# EAGLE board Master (EAGLE 6.5.0)
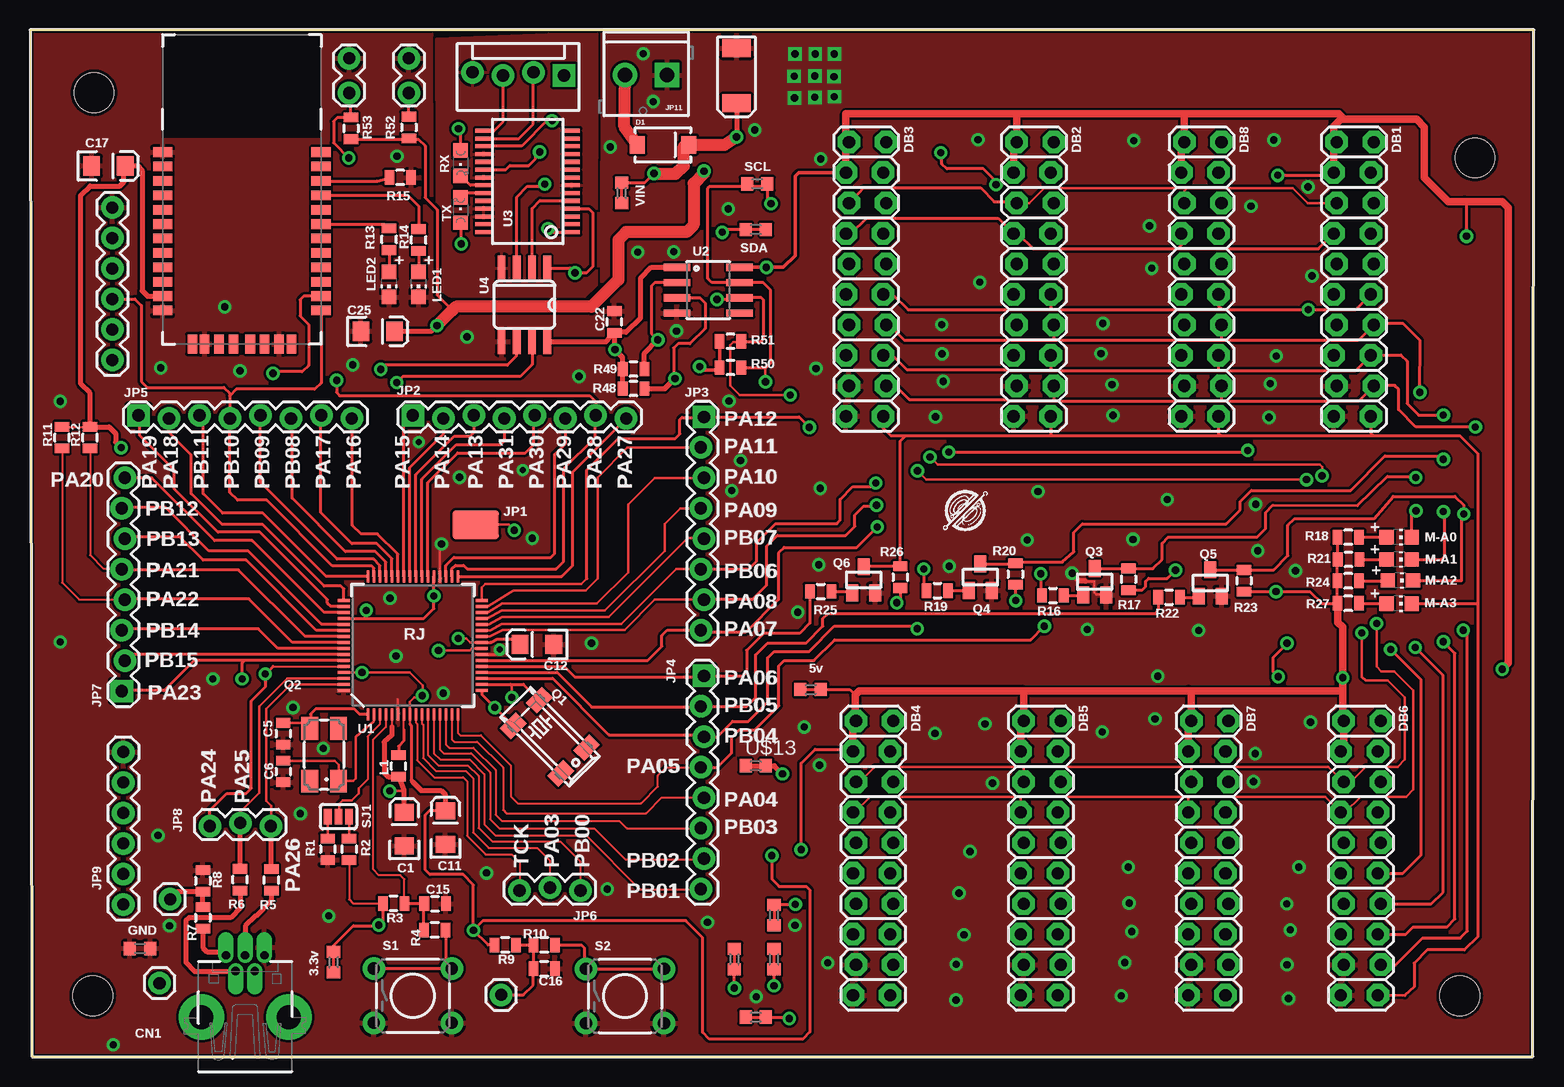
[diagram p4: board, top side]
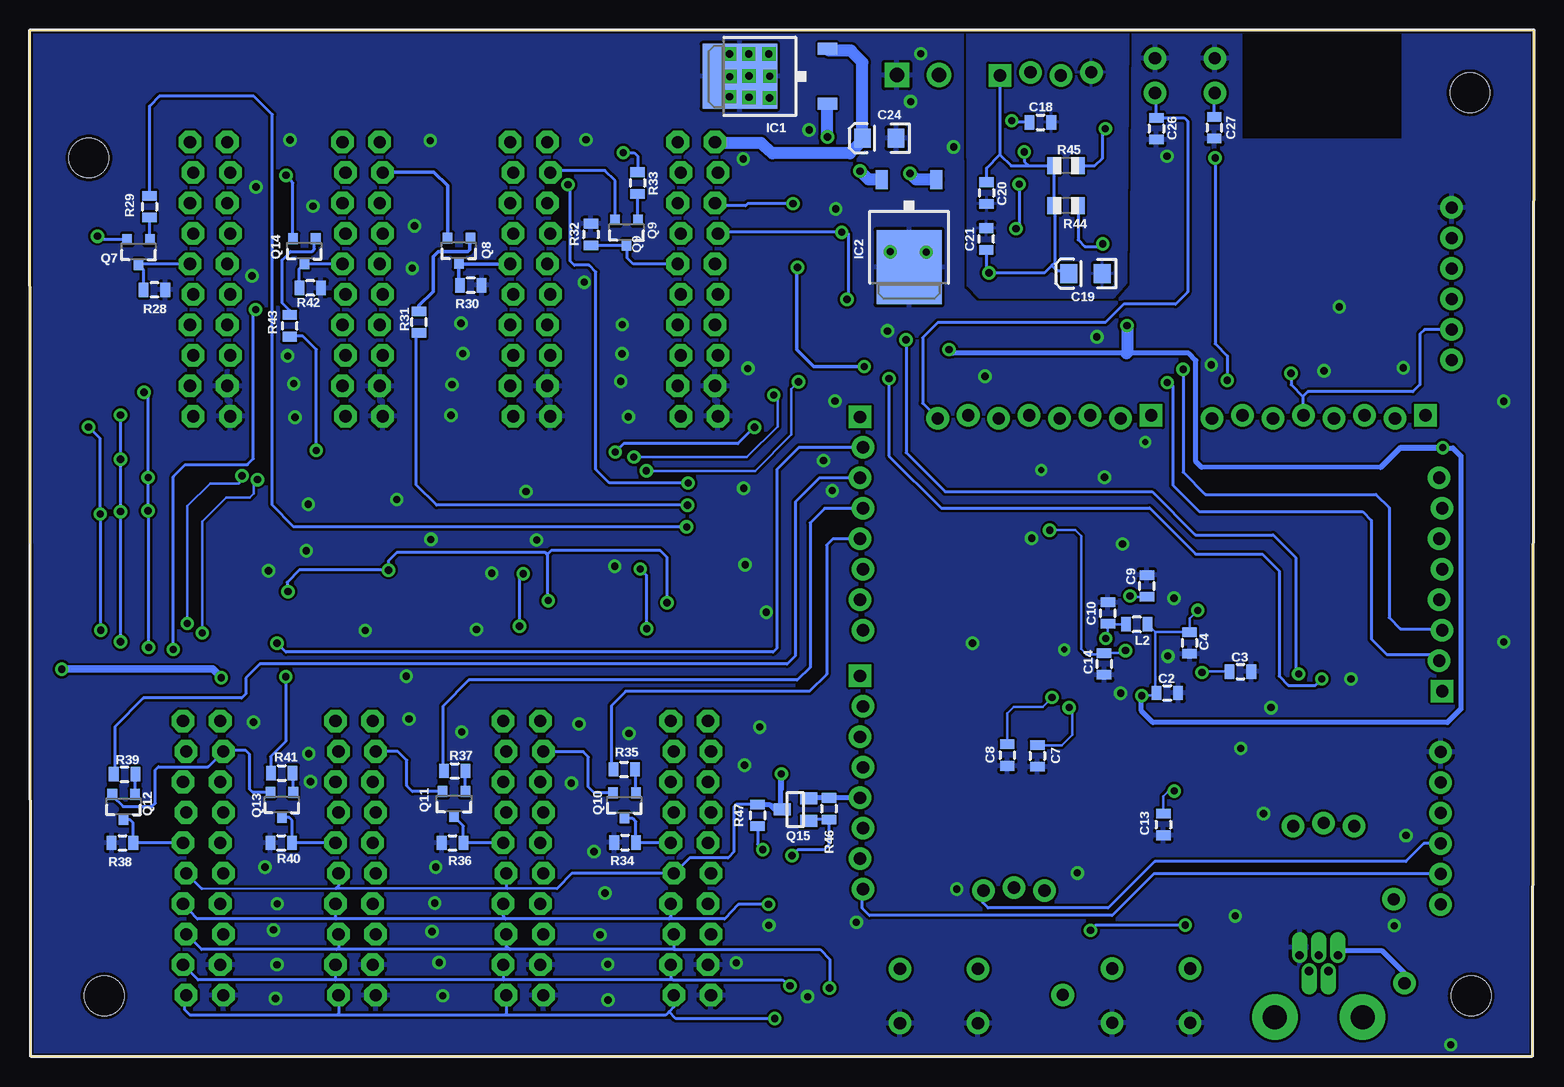
[diagram p5: board, bottom side, seen from below]

Size 125.33 x 85.6 mm. Coordinates in mm from the lower left corner, seen from the top.
Outline: 0.15,0 125.25,0 125.33,85.6 0,85.6 0.15,0
Copper layers (1*16): Top 0.035mm / dielectric 1.5mm / Bottom 0.035mm
Design rules "SparkFun": minimum track width 8mil, minimum drill 20mil, track to track 8mil, track to pad 8mil, pad to pad 8mil, via to via 8mil, smd to smd 8mil, copper to edge 10mil, drill to drill 8mil, minimum pad ring 12mil, minimum via ring 10mil, stop-mask expansion 4mil, vias tented up to drill 25mil, thermal gap 10mil
tRestrict: area 11,76.6 to 24.2,85.3
bRestrict: area 11,76.6 to 24.3,85.2

## Footprints (pad centres in the part's own frame; a part is rotated, then mirrored left to right if it is on the bottom)
EIA3216 = smd 1.4 x 1.6: A 1.4,0; C -1.4,0
0805 = smd 0.8 x 1.2: 1 -0.9,0; 2 0.9,0
EIA6032 = smd 1.5 x 2.4: P$1 -2.3,0; P$2 2.3,0
USB-MINIB-THM-MOLEX = drill 0.7 offset: D+ 0,9.72; D- -0.8,8.42; GND 1.6,9.72; ID 0.8,8.42; VBUS -1.6,9.72 | drill 2 pad 3.81: GND1 -3.65,4.57; GND4 3.65,4.57
SMA-DIODE = smd 1.27 x 1.47: A -2.15,0; C 2.15,0
2X10_LOCK_SPECIAL = drill 1.016 pad 1.88 octagon: 1 -11.43,-1.422; 2 -11.43,1.676; 3 -8.89,-1.676; 4 -8.89,1.422; 5 -6.35,-1.422; 6 -6.35,1.676; 7 -3.81,-1.676; 8 -3.81,1.422; 9 -1.27,-1.422; 10 -1.27,1.676; 11 1.27,-1.676; 12 1.27,1.422; 13 3.81,-1.422; 14 3.81,1.676; 15 6.35,-1.676; 16 6.35,1.422; 17 8.89,-1.422; 18 8.89,1.676; 19 11.43,-1.676; 20 11.43,1.422
TO252 = smd 1 x 1.6: 1 -2.28,-4.8; 2 2.28,-4.8 | smd 5.4 x 6.2: 3 0,2.5
LUXEON-PAD = smd 3.9 x 2.4: P$1 0,0
1X08_LOCK = drill 1.016 pad 1.88 square: 1 0,0.127 | drill 1.016 pad 1.88: 2 2.54,-0.127; 3 5.08,0.127; 4 7.62,-0.127; 5 10.16,0.127; 6 12.7,-0.127; 7 15.24,0.127; 8 17.78,-0.127
1X03_LOCK = drill 1.016 pad 1.88: 1 0,0.127; 2 2.54,-0.127; 3 5.08,0.127
FTDI_BASIC = drill 1.016 pad 1.88: CTS 10.16,0; DTR 0,0; GND 12.7,0; RXI 2.54,0; TXO 5.08,0; VCC 7.62,0
SCREWTERMINAL-3.5MM-2 = drill 1.2 pad 2.032 square: 1 0,0 | drill 1.2 pad 2.032: 2 3.5,0
MOLEX-1X4_LOCK = drill 1.016 pad 1.88 square: 1 0,0.127 | drill 1.016 pad 1.88: 2 2.54,-0.127; 3 5.08,0.127; 4 7.62,-0.127
1X01 = drill 1.016 pad 1.88: 1 0,0
1X02_LOCK = drill 1.016 pad 1.88: 1 -0.178,0; 2 2.718,0
CHIP-LED0805 = smd 1.2 x 1.2: A 0,-1.05; C 0,1.05
MM20SS = smd 1.27 x 1.88: 1 -2.794,-1.524; 2 2.794,-1.524; 3 2.794,1.524; 4 -2.794,1.524
CTS406 = smd 1.9 x 1.4: 1 -2.2,-1.2; 2 2.2,-1.2; 3 2.2,1.2; 4 -2.2,1.2
SOT23 = smd 1 x 1.4: 1 -0.95,-1.1; 2 0.95,-1.1; 3 0,1.1
SOT23-3 = smd 0.8 x 0.9: 1 -0.95,-1; 2 0.95,-1; 3 0,1.1
R0805 = smd 1.1 x 1.4: 1 -1,0; 2 1,0
CHIPLED_0805 = smd 1.2 x 1.2: A 0,-1.05; C 0,1.05
TACTILE-PTH = drill 1.016 pad 1.88: 1 -3.251,2.261; 2 3.251,2.261; 3 -3.251,-2.261; 4 3.251,-2.261
SJ_3 = smd 0.635 x 1.27: 1 -0.889,0; 2 0,0; 3 0.889,0
STAND-OFF = hole 3.302: 0,0
TQFP-64 = smd 0.22 x 1: 1 -3.75,-5.75; 2 -3.25,-5.75; 3 -2.75,-5.75; 4 -2.25,-5.75; 5 -1.75,-5.75; 6 -1.25,-5.75; 7 -0.75,-5.75; 8 -0.25,-5.75; 9 0.25,-5.75; 10 0.75,-5.75; 11 1.25,-5.75; 12 1.75,-5.75; 13 2.25,-5.75; 14 2.75,-5.75; 15 3.25,-5.75; 16 3.75,-5.75; 33 3.75,5.75; 34 3.25,5.75; 35 2.75,5.75; 36 2.25,5.75; 37 1.75,5.75; 38 1.25,5.75; 39 0.75,5.75; 40 0.25,5.75; 41 -0.25,5.75; 42 -0.75,5.75; 43 -1.25,5.75; 44 -1.75,5.75; 45 -2.25,5.75; 46 -2.75,5.75; 47 -3.25,5.75; 48 -3.75,5.75 | smd 1 x 0.22: 17 5.75,-3.75; 18 5.75,-3.25; 19 5.75,-2.75; 20 5.75,-2.25; 21 5.75,-1.75; 22 5.75,-1.25; 23 5.75,-0.75; 24 5.75,-0.25; 25 5.75,0.25; 26 5.75,0.75; 27 5.75,1.25; 28 5.75,1.75; 29 5.75,2.25; 30 5.75,2.75; 31 5.75,3.25; 32 5.75,3.75; 49 -5.75,3.75; 50 -5.75,3.25; 51 -5.75,2.75; 52 -5.75,2.25; 53 -5.75,1.75; 54 -5.75,1.25; 55 -5.75,0.75; 56 -5.75,0.25; 57 -5.75,-0.25; 58 -5.75,-0.75; 59 -5.75,-1.25; 60 -5.75,-1.75; 61 -5.75,-2.25; 62 -5.75,-2.75; 63 -5.75,-3.25; 64 -5.75,-3.75
SO-8 = smd 0.61 x 2.21: 1 -1.905,-2.616; 2 -0.635,-2.616; 3 0.635,-2.616; 4 1.905,-2.616; 5 1.905,2.616; 6 0.635,2.616; 7 -0.635,2.616; 8 -1.905,2.616
SSOP28DB = smd 0.348 x 1.397: 1 -4.225,-3.656; 2 -3.575,-3.656; 3 -2.925,-3.656; 4 -2.275,-3.656; 5 -1.625,-3.656; 6 -0.975,-3.656; 7 -0.325,-3.656; 8 0.325,-3.656; 9 0.975,-3.656; 10 1.625,-3.656; 11 2.275,-3.656; 12 2.925,-3.656; 13 3.575,-3.656; 14 4.225,-3.656; 15 4.225,3.656; 16 3.575,3.656; 17 2.925,3.656; 18 2.275,3.656; 19 1.625,3.656; 20 0.975,3.656; 21 0.325,3.656; 22 -0.325,3.656; 23 -0.975,3.656; 24 -1.625,3.656; 25 -2.275,3.656; 26 -2.925,3.656; 27 -3.575,3.656; 28 -4.225,3.656
SOIC-8 = smd 0.66 x 2.032: 1 -1.905,-3.073; 2 -0.635,-3.073; 3 0.635,-3.073; 4 1.905,-3.073; 5 1.905,3.073; 6 0.635,3.073; 7 -0.635,3.073; 8 -1.905,3.073
RN41 = smd 0.8 x 1.6: 1 -6.6,-6.6; 2 -5.4,-6.6; 3 -4.2,-6.6; 4 -3,-6.6; 5 -1.8,-6.6; 6 -0.6,-6.6; 7 0.6,-6.6; 8 1.8,-6.6; 9 3,-6.6; 10 4.2,-6.6; 11 5.4,-6.6; 12 6.6,-6.6; 13 6.6,6.6; 14 5.4,6.6; 15 4.2,6.6; 16 3,6.6; 17 1.8,6.6; 18 0.6,6.6; 19 -0.6,6.6; 20 -1.8,6.6; 21 -3,6.6; 22 -4.2,6.6; 23 -5.4,6.6; 24 -6.6,6.6 | smd 1.6 x 0.8: 28 9.4,3.1; 29 9.4,-3.1; 30 9.4,4.122; 31 9.4,1.9; 32 9.4,0.7; 33 9.4,-0.7; 34 9.4,-1.9; 35 9.4,-4.122
R0603 = smd 1 x 1.1: 1 -0.85,0; 2 0.85,0

## Placement (x,y rotation side)
C1  10uF  [EIA3216]  31.19,18.97 90 top
C2  0.1uF  [0805]  30.56,30.33 0 bottom
C3  0.1uF  [0805]  24.46,32.11 0 bottom
C4  0.1uF  [0805]  28.7,34.49 270 bottom
C5  18pF  [0805]  21.11,26.92 270 top
C6  18pF  [0805]  21.11,23.77 270 top
C7  12.5pF  [0805]  41.38,25.07 270 bottom
C8  12.5pF  [0805]  43.89,25.15 270 bottom
C9  0.1uF  [0805]  32.26,39.24 90 bottom
C10  0.1uF  [0805]  35.51,36.98 90 bottom
C11  10uF  [EIA3216]  34.62,19.1 90 top
C12  10uF  [EIA3216]  42.24,34.37 180 top
C13  0.1uF  [0805]  30.89,19.35 270 bottom
C14  0.1uF  [0805]  35.81,32.74 270 bottom
C15  0.01uF  [0805]  33.76,12.75 0 top
C16  0.01uF  [0805]  42.85,7.34 0 top
C17  10uF  [EIA3216]  6.53,74.27 0 top
C18  0.1uf  [0805]  41.12,77.9 0 bottom
C19  10uF  [EIA3216]  37.36,65.28 180 bottom
C20  0.1uf  [0805]  45.62,72.01 270 bottom
C21  0.1uf  [0805]  45.64,68.17 90 bottom
C22  0.1uf  [0805]  48.69,61.26 90 top
C23  10uF  [EIA6032]  58.88,81.79 90 top
C24  10uF  [EIA3216]  54.56,76.58 180 bottom
C25  10uF  [EIA3216]  28.98,60.48 0 top
C26  0.01uF  [0805]  31.47,77.37 270 bottom
C27  0.01uF  [0805]  26.64,77.44 270 bottom
CN1  [USB-MINIB-THM-MOLEX]  17.93,-1.27 0 top
D1  [SMA-DIODE]  52.76,76.02 0 top
DB1  [2X10_LOCK_SPECIAL]  110.31,64.82 270 top
DB2  [2X10_LOCK_SPECIAL]  83.64,64.82 270 top
DB3  [2X10_LOCK_SPECIAL]  69.67,64.82 270 top
DB4  [2X10_LOCK_SPECIAL]  70.26,16.56 270 top
DB5  [2X10_LOCK_SPECIAL]  84.23,16.56 270 top
DB6  [2X10_LOCK_SPECIAL]  110.9,16.56 270 top
DB7  [2X10_LOCK_SPECIAL]  98.2,16.56 270 top
DB8  [2X10_LOCK_SPECIAL]  97.61,64.82 270 top
IC1  7805  [TO252]  63.68,81.74 90 bottom
IC2  LD29080DT33R  [TO252]  52.07,68.33 180 bottom
JP1  M01SMD  [LUXEON-PAD]  37.13,44.35 0 top
JP2  [1X08_LOCK]  31.9,53.34 0 top
JP3  [1X08_LOCK]  56.03,53.34 270 top
JP4  [1X08_LOCK]  56.03,31.75 270 top
JP5  [1X08_LOCK]  9.04,53.34 0 top
JP6  [1X03_LOCK]  45.87,13.97 180 top
JP7  [1X08_LOCK]  7.77,30.48 90 top
JP8  [1X03_LOCK]  20.07,19.35 180 top
JP9  FTDI  [FTDI_BASIC]  7.77,12.7 90 top
JP10  FTDI_BASICPTH  [FTDI_BASIC]  6.86,58.09 90 top
JP11  M023.5MM  [SCREWTERMINAL-3.5MM-2]  53.09,81.84 180 top
JP12  [MOLEX-1X4_LOCK]  44.5,81.94 180 top
JP13  M01PTH  [1X01]  39.27,5.16 0 top
JP14  E-STOP  [1X02_LOCK]  26.59,83.06 270 top
JP15  KEY  [1X02_LOCK]  31.57,83.06 270 top
JP16  M01PTH  [1X01]  11.68,13.13 0 top
JP17  M01PTH  [1X01]  10.79,6.12 0 top
L1  22uH  [0805]  30.71,24.23 90 top
L2  FB -1.5k@100Mz  [0805]  33.1,36.04 180 bottom
LED1  [CHIP-LED0805]  32.38,64.39 180 top
LED2  [CHIP-LED0805]  29.92,64.39 180 top
M-A0  Green  [CHIP-LED0805]  114.1,43.31 270 top
M-A1  [CHIP-LED0805]  114.1,41.45 270 top
M-A2  [CHIP-LED0805]  114.2,39.7 270 top
M-A3  [CHIP-LED0805]  114.1,37.77 270 top
Q1  32.768khz  [MM20SS]  43.33,26.67 315 top
Q2  12Mhz  [CTS406]  24.51,25.17 90 top
Q3  BSS123  [SOT23]  88.72,39.6 0 top
Q4  BSS123  [SOT23]  79.2,39.98 0 top
Q5  BSS123  [SOT23]  98.35,39.5 0 top
Q6  BSS123  [SOT23]  69.47,39.75 0 top
Q7  PMBT3906  [SOT23-3]  116.28,67.13 180 bottom
Q8  PMBT3906  [SOT23-3]  89.59,67.23 180 bottom
Q9  PMBT3906  [SOT23-3]  75.62,68.76 180 bottom
Q10  PMBT3906  [SOT23-3]  75.79,21.01 180 bottom
Q11  PMBT3906  [SOT23-3]  89.99,21.11 180 bottom
Q12  PMBT3906  [SOT23-3]  117.53,20.88 180 bottom
Q13  PMBT3906  [SOT23-3]  104.34,21.03 180 bottom
Q14  PMBT3906  [SOT23-3]  102.46,67.21 180 bottom
Q15  BSS123  [SOT23]  61.54,20.6 90 bottom
R1  100k  [0805]  24.82,17.3 270 top
R2  100k  [0805]  26.59,17.3 270 top
R3  100k  [0805]  30.3,12.78 180 top
R4  10  [0805]  33.73,10.57 180 top
R5  39  [0805]  20.12,14.73 90 top
R6  39  [0805]  17.5,14.76 90 top
R7  820k  [0805]  14.4,11.58 270 top
R8  1M  [0805]  14.4,14.66 270 top
R9  100k  [0805]  39.6,9.32 180 top
R10  10  [0805]  42.85,9.32 180 top
R11  2.2k  [0805]  2.67,51.61 90 top
R12  2.2k  [0805]  5,51.61 90 top
R13  330  [0805]  29.92,68.15 90 top
R14  330  [0805]  32.38,68.1 90 top
R15  10k  [0805]  30.86,73.3 180 top
R16  1k  [0805]  85.24,38.46 0 top
R17  10k  [0805]  91.54,39.8 270 top
R18  1k  [0805]  109.86,43.31 180 top
R19  1k  [0805]  75.62,38.86 0 top
R20  10k  [0805]  82.12,40.23 270 top
R21  1k  [0805]  109.88,41.45 180 top
R22  1k  [0805]  94.92,38.3 0 top
R23  10k  [0805]  101.17,39.67 270 top
R24  1k  [0805]  109.86,39.67 180 top
R25  1k  [0805]  65.89,38.79 0 top
R26  10k  [0805]  72.52,39.98 270 top
R27  1k  [0805]  109.86,37.8 180 top
R28  10k  [0805]  114.96,63.93 180 bottom
R29  1k  [0805]  115.37,70.87 270 bottom
R30  10k  [0805]  88.6,64.31 180 bottom
R31  1k  [0805]  92.91,61.24 90 bottom
R32  10k  [0805]  78.59,68.55 270 bottom
R33  1k  [0805]  74.7,72.85 270 bottom
R34  10k  [0805]  75.74,17.86 0 bottom
R35  1k  [0805]  75.82,23.95 0 bottom
R36  10k  [0805]  90.12,17.83 0 bottom
R37  1k  [0805]  89.94,23.83 0 bottom
R38  10k  [0805]  117.63,17.83 0 bottom
R39  1k  [0805]  117.45,23.55 0 bottom
R40  10k  [0805]  104.39,17.83 0 bottom
R41  1k  [0805]  104.34,23.65 0 bottom
R42  10k  [0805]  101.98,64.08 180 bottom
R43  1k  [0805]  103.68,60.93 90 bottom
R44  1K  [R0805]  38.99,70.94 180 bottom
R45  1k  [R0805]  38.99,74.3 180 bottom
R46  10k  [0805]  58.75,20.68 270 bottom
R47  10k  [0805]  64.69,20.12 270 bottom
R48  10k  [0805]  50.29,55.7 180 top
R49  10k  [0805]  50.29,57.33 180 top
R50  10k  [0805]  58.37,57.45 180 top
R51  10k  [0805]  58.37,59.64 180 top
R52  100k  [0805]  31.57,77.47 270 top
R53  100k  [0805]  26.75,77.39 270 top
RX  [CHIPLED_0805]  35.89,74.5 180 top
S1  RSET  [TACTILE-PTH]  31.9,5.08 0 top
S2  BOOT  [TACTILE-PTH]  49.58,5.05 0 top
SJ1  [SJ_3]  25.7,20.02 180 top
STANDOFF1  STAND-OFF  [STAND-OFF]  5.23,5.08 0 top
STANDOFF2  STAND-OFF  [STAND-OFF]  119.15,5.08 0 top
STANDOFF3  STAND-OFF  [STAND-OFF]  5.33,80.37 0 top
STANDOFF4  STAND-OFF  [STAND-OFF]  120.42,74.93 0 top
TX  [CHIPLED_0805]  35.89,70.59 0 top
U1  ATSAM4LS  [TQFP-64]  31.9,34.29 0 top
U2  PCA9508DPSO  [SO-8]  56.52,63.91 270 top
U3  FT232RL-BASICSSOP  [SSOP28DB]  41.48,72.97 90 top
U4  ISO7221ADR  [SOIC-8]  41.2,62.69 180 top
U$1  BLUETOOTH-RN41"  [RN41]  17.65,68.81 270 top
U$2  TESTPOINT  [R0603]  60.6,72.77 180 top
U$3  TESTPOINT  [R0603]  60.48,68.96 0 top
U$4  TESTPOINT  [R0603]  62,11.81 90 top
U$5  TESTPOINT  [R0603]  58.7,8.13 90 top
U$6  TESTPOINT  [R0603]  62,8.13 90 top
U$7  TESTPOINT  [R0603]  60.48,3.3 0 top
U$8  TESTPOINT  [R0603]  65.05,30.61 0 top
U$9  TESTPOINT  [R0603]  25.3,7.87 90 top
U$10  TESTPOINT  [R0603]  9.17,9.02 0 top
U$11  TESTPOINT  [R0603]  49.3,72.01 90 top
U$12  LOGO  [LOGO-S]  75.74,43.41 0 top
U$13  TESTPOINT  [R0603]  60.48,24.26 0 top

## Tracks (layer width: path | path; a pad name or v marks a point on that pad's centre or on a via)
3V  (via drill 0.6)
  Top 0.254: v43.51,78.03 43.08,78.03 40.97,75.92 37.84,75.92 U3.17
  Bottom 0.254: C18.1 43.38,77.9 v43.51,78.03
+3V3  (via drill 0.6)
  Top 0.178: U1.8 31.65,27.76 | R11.2 R12.2 | R2.2 26.59,13.11 26.9,12.8 29.38,12.8 R3.2
  Top 0.203: U1.8 31.65,29.59 32.03,29.97 32.56,29.97 v32.69,30.1 32.72,30.12 32.72,30.96 31.65,32.03 v27.66,32.03 U1.61 | v28.02,37.21 28.02,36.72 27.84,36.54
  Top 0.254: U1.52 27.84,36.54 32.83,36.54 33.66,37.36 v33.66,38.41 33.66,39.99 U1.37 | R3.2 29.4,11.32 v29.06,10.97 29.01,10.92 26.95,10.92 25.3,9.27 U$9.2 U$9.1 | v36.96,10.54 36.96,14.33 36.09,15.19 33.32,15.19 32.92,15.6 32.92,20.14 33.32,20.55 34.57,20.55 C11.A | R9.2 38.18,9.32 v36.96,10.54 | v61.82,16.76 61.82,14.81 62.43,14.2 64.69,14.2 65,13.89 65,2.06 64.41,1.47 56.62,1.47 56.06,2.03 56.06,9.93 54.66,11.33 37.74,11.33 v36.96,10.54 | R53.2 31.5,76.49 | 31.5,76.49 R52.2 | 31.5,76.49 32.37,76.49 32.92,75.95 32.92,71.63 33.93,70.61 33.93,63.5 35.19,62.24 | 31.65,27.76 31.65,27.71 31.75,27.61 31.75,23.04 31.88,22.91
  Top 0.406: 31.88,22.91 32.59,22.2 34.26,22.2 34.59,21.87 34.59,20.53 C11.A | U$1.11 11.04,63.4 9.8,63.4 9.35,63.86 9.35,73.89 8.97,74.27 C17.A 7.82,74.17 7.82,72.92 7.49,72.59 5,72.59 4.24,71.83 4.24,56.08 5,55.32 R12.2 6.59,52.51 7.14,51.97 7.14,51.23 v7.59,50.77 | U4.8 48.02,59.61 C22.1 | C22.1 48.73,60.4 49.68,60.4 50.88,61.59 50.88,64.9 51.79,65.81 U2.1 | C22.1 48.74,60.31 v48.74,58.95 49.39,58.3 R49.2 R48.2 | C25.A 33.43,60.48 v33.91,60.96
  Top 1.016: v56.16,73.84 56.16,73.66 55.3,72.8 55.3,69.34 54.71,68.76 49.68,68.76 49.02,68.1 49.02,64.77 46.79,62.53 35.48,62.53 35.19,62.24 v33.91,60.96
  Bottom 0.203: v32.69,30.1 31.68,30.1 C2.1 31.55,30.42 31.55,35.39 | C3.1 27.58,32.11 v27.66,32.03 | v28.02,37.21 28.7,36.52 C4.1 31.55,35.39 | C9.1 33.62,38.34 v33.66,38.41 | 31.55,35.39 L2.1
  Bottom 0.254: v29.06,10.97 36.53,10.97 v36.96,10.54 | Q15.1 60.32,19.78 R46.2 58.75,17.63 59.13,17.25 61.34,17.25 v61.82,16.76
  Bottom 0.406: v7.59,50.77 11.15,50.77 12.8,49.12 | 12.8,49.12 27.71,49.15 28.17,49.61 28.17,58.04 28.78,58.65 33.93,58.65 48.44,58.65 v48.74,58.95 | 12.8,49.12 12.78,49.12 11.15,50.75 6.76,50.75 6.1,50.09 6.1,28.98 7.21,27.86 31.75,27.86 32.72,28.83 32.72,30.07 v32.69,30.1
  Bottom 1.016: IC2.2 55.45,73.13 v56.16,73.84 | v33.91,60.96 33.91,58.67 33.93,58.65
+5V  (via drill 0.6)
  Top 0.254: R18.2 108.98,43.28 R21.2 108.96,41.43 R24.2 R27.2 108.93,37.77 107.67,37.77 106.67,38.77 v103.84,38.77 R23.2 | v64.26,17.27 64.26,24.46 65.43,25.63 68.4,25.63 DB4.3 | R26.2 72.52,38.12 v72.24,37.85 | v82.14,38.02 82.14,39.31 R20.2 | R17.2 92.67,38.9 92.96,39.19 92.96,39.62 93.22,39.88 94.77,39.88 v95.45,40.56 | v103.99,73.48 108.41,73.48 DB1.3 | v119.71,68.4 119.71,71.12 119.53,71.3 | U$8.1 U$8.2 68.3,30.61 68.76,30.15
  Top 0.305: U2.8 v61.37,65.81 62.79,65.81 63.78,66.8 63.78,73.43 64.06,73.71 DB3.3 | R50.2 R51.2 R50.2 57.28,57.25 56.08,57.25 v55.8,57.53
  Top 0.406: DB1.1 108.74,76.25 108.64,76.35
  Top 0.61: DB4.3 68.58,27.74 DB4.1 68.76,28.07 68.76,30.15 69.11,30.5 82.52,30.5 | DB5.3 82.55,27.74 DB5.1 82.8,30.4 82.7,30.5 | 82.55,30.48 82.52,30.5 | 82.52,30.5 82.7,30.5 | 82.7,30.5 96.55,30.5 | 96.55,30.5 109.4,30.5 | 109.4,30.5 109.4,28.07 DB6.1 109.47,25.7 DB6.3 | 96.55,30.5 96.77,30.28 DB7.1 96.52,27.74 DB7.3 | R27.2 108.99,37.76 108.99,36.22 109.4,35.81 v109.4,31.6 109.4,30.5 | DB1.3 108.64,76.35 108.64,77.57 109.22,78.16 109.52,78.16 | 109.52,78.16 115.54,78.16 116.21,77.5 116.21,73.28 118.19,71.3 119.53,71.3 122.68,71.3 123.19,70.79 123.19,32.82 v122.68,32.31 | DB3.3 68,76.35 | 68,76.35 68,78.61 82.32,78.61 | 82.32,78.61 96.06,78.61 | 96.06,78.61 109.07,78.61 109.52,78.16 | 96.06,78.61 96.19,78.49 DB8.1 95.94,76 DB8.3 | 82.32,78.61 82.22,78.51 DB2.1 81.97,76 DB2.3 | DB3.1 68.1,76.25 68,76.35
  Bottom 0.254: Q10.2 78.32,22.01 78.79,22.48 78.79,24.99 79.22,25.43 82.52,25.43 DB5.3 | Q11.2 93.46,22.11 93.93,22.58 93.93,24.71 94.67,25.45 DB7.3 | Q13.2 106.77,22.03 107.04,22.3 107.04,25.22 107.34,25.53 109.14,25.53 DB6.3 110.49,24.18 114.63,24.18 114.88,23.93 114.88,21.13 115.16,20.85 117.58,20.85 118.48,21.75 Q12.2 | R47.2 64.69,17.7 v64.26,17.27 | v72.24,37.85 72.24,41.63 72.82,42.22 81.89,42.22 82.22,41.88 | 82.22,41.88 82.22,38.1 v82.14,38.02 | 82.22,41.88 82.4,42.06 94.74,42.06 95.45,41.35 v95.45,40.56 102.9,40.56 103.91,39.55 103.91,38.85 v103.84,38.77 | Q9.2 76.57,73.03 77.42,73.89 81.79,73.89 DB2.3 | Q14.2 103.41,72.83 v103.99,73.48 | Q7.2 119.44,68.13 v119.71,68.4
  Bottom 0.305: v55.8,57.53 60.02,57.53 61.44,58.95 61.44,65.73 v61.37,65.81 | Q8.2 90.54,72.6 91.69,73.76 95.89,73.76 DB8.3
  Bottom 0.61: v122.68,32.31 110.11,32.31 v109.4,31.6
  Bottom 1.016: IC1.2 58.73,83.87 56.92,83.87 55.96,82.91 C24.A 55.96,76.35 57,75.31 63.47,75.31 64.41,76.17 68.17,76.17 DB3.1
CLK
  Top 0.178: R11.1 2.67,39.52 4.09,38.1 JP7.4
  Top 0.254: U1.56 21.87,34.54 18.24,38.18 7.98,38.18 JP7.4
DAT
  Top 0.178: R12.1 5,41.81 6.12,40.69 7.59,40.69 JP7.5
  Top 0.254: U1.55 22.92,35.04 17.37,40.59 7.7,40.59 JP7.5
DB1EN-MUX
  Bottom 0.254: DB1.10 116.22,66.09 Q7.3 115.86,65.61 R28.2
DB2EN-MUX
  Bottom 0.305: DB2.10 89.54,66.09 Q8.3 89.59,64.4 R30.2
DB3EN-MUX
  Bottom 0.254: R32.2 Q9.3 75.54,67.58 75.54,66.57 75.06,66.09 DB3.10
DB4EN-MUX
  Bottom 0.254: DB4.10 74.82,17.83 R34.2 74.84,19.6 75.11,19.86 75.75,19.86 Q10.3
DB5EN-MUX
  Bottom 0.254: DB5.10 R36.2 89.22,19.23 Q11.3
DB6EN-MUX
  Bottom 0.254: DB6.10 R38.2 116.73,19.5 116.99,19.76 117.51,19.76 Q12.3
DB7EN-MUX
  Bottom 0.254: DB7.10 R40.2 103.49,19.7 103.73,19.94 Q13.3
DB8EN-MUX
  Bottom 0.254: R42.2 102.88,65.69 Q14.3 102.45,66.09 DB8.10
GND  (via drill 0.5, 0.6)
  Top 0.203: U1.6 30.65,29.75 30.63,29.77 | U1.36 34.15,42.61 v34.29,42.75 | Q3.2 89.64,38.53 88.85,38.53 88.7,38.68 88.7,39.57 88.67,39.6 88.14,39.6 87.96,39.65
  Top 0.254: U1.23 38.82,33.54 38.86,33.58
  Top 0.406: 87.96,39.65 87.38,39.65 v86.84,40.31
  other vias: 39.14,33.93 41.07,48.92 32.38,51.26 21.92,29.11 41.86,43.23 15.24,31.5 30,38.23 34.44,30.3 30.51,33.4 35.79,48.31 46.79,34.47 22.53,20.27 24.43,25.7 24.89,11.73 6.93,0.99 11.63,10.92 38.05,15.32 48.11,13.97 10.67,18.44 63.75,10.95 77.83,10.16 91.82,10.44 105.03,10.57 77.42,13.64 91.59,12.8 104.72,12.75 103.25,53.31 103.35,56.11 90.17,56.03 90.25,53.47 75.46,53.34 76.1,56.31 75.97,61.04 76,58.6 89.26,58.62 106.83,65.1 93.47,65.74 79.15,64.57 93.29,69.27 106.5,72.52 78.99,76.45 66.47,7.82 60.53,5 63.98,37.06 104.75,7.67 104.88,4.85 91.24,7.85 90.93,5.08 77.19,7.7 77.17,4.72 105.74,15.8 91.52,15.8 78.33,17.09 79.58,27.74 93.75,28.17 106.71,27.89 102.11,25.27 89.36,27.08 75.41,26.95 80.21,22.81 101.96,22.94 65.74,41.02 76.61,40.89 88.11,35.61 97.38,35.53 102.31,42.19 91.92,43.13 94.77,46.46 102.13,46.05 105.46,40.51 84,47.12 83.11,43.08 93.98,31.72 56.46,11.2 64.52,27.48 91.97,76.38 103.66,76.43 101.75,70.92 103.86,58.42 89.41,61.14 65.86,47.4 65.51,57.38 58.24,54.66 59.21,49.71 58.47,47.19 65.89,74.85 58.19,70.69 60.4,77.27 51.94,79.63 51.1,83.62 48.36,75.84 63.75,83.59 63.68,81.74 63.7,79.93 65.41,79.98 65.41,81.76 65.43,83.59 67.03,83.59 67.01,81.71 67.03,80.04 53.87,60.5 45.75,56.72 50.65,67.08 36.42,60.02 26.9,57.68 17.5,57.18 16.23,62.51 10.9,57.43 2.51,54.64 2.51,34.57 30.58,75.08 65.79,24.31 53.64,67.11
  pour Top (rank 3): 0.15,0 125.12,0 125.37,85.6 0.03,85.6
  pour Bottom (rank 3): 0.15,0 125.25,0 125.5,85.52 0.15,85.52
GNDIO
  pour Top: 33.91,84.89 47.22,85.39 47.17,64.29 46.2,63.32 35.08,63.37 33.99,64.06
  pour Bottom: 33.81,85.24 47.24,85.39 47.19,64.31 46.23,63.35 35.05,63.35 33.96,64.57
I2C-CLK  (via drill 0.6)
  Top 0.178: 20.27,32.54 U1.60
  Top 0.254: 20.27,32.54 v19.61,31.9 19.63,31.88 19.63,30.86 18.44,29.67 18.44,22.38 18.01,21.95 16.41,21.95 14.99,20.52 JP8.3 | U2.2 52.07,64.54 51.79,64.26 51.79,60.3 v52.32,59.77
  Top 0.406: R49.1 51.19,58.63 v52.32,59.77
  Bottom 0.254: v52.32,59.77 52.32,50.37 49.07,47.12 31.83,47.12 28.22,43.51 21.74,43.51 19.86,41.63 19.86,32.16 v19.61,31.9
I2C-DAT  (via drill 0.6)
  Top 0.254: U1.59 17.88,33.04 | 17.88,33.04 13.69,33.04 11.18,30.53 7.7,30.53 JP7.1 | v17.68,31.5 17.68,32.84 17.88,33.04 | U2.3 55.83,63.27 56.26,62.84 56.26,60.71 54.99,59.44 54,59.44 53.64,59.08 53.64,56.64 v53.75,56.54
  Top 0.406: R48.1 52.91,55.7 v53.75,56.54
  Bottom 0.254: v53.75,56.54 53.75,50.09 49.4,45.74 32.03,45.74 28.19,41.91 22.63,41.91 21.23,40.51 21.23,31.73 20.47,30.96 18.21,30.96 v17.68,31.5
M0  (via drill 0.6)
  Top 0.178: U1.16 35.65,26.98 35.84,26.8 37.57,26.8 40.08,24.28 40.08,21.69 40.64,21.13 50.93,21.13 52.32,22.53 52.32,23.44 53.01,24.13 JP4.4
  Top 0.254: JP4.4 57.28,24.13 58.47,25.32 58.47,26.62 59.11,27.25 60.4,27.25 62.41,29.26 62.41,32.59 62.84,33.02 65.33,33.02 67.06,34.75 83.39,34.75 v84.53,35.89 | v84.23,40.26 84.23,38.57 R16.1
  Bottom 0.254: v84.53,35.89 84.53,39.95 v84.23,40.26
M0E1  (via drill 0.6)
  Top 0.254: U1.22 51.48,33.04 52.65,34.21 52.65,35.1 53.11,35.56 JP3.8 56.08,35.38 59.64,35.38 62.36,38.1 62.36,41.99 62.84,42.47 68.91,42.47 v70.61,44.17
  Bottom 0.254: v70.61,44.17 103.35,44.17 105.13,45.97 105.13,78.54 106.68,80.06 114.55,80.06 115.37,79.25 R29.1
M0E2  (via drill 0.6)
  Top 0.203: U1.26 38.33,35.05 39.4,35.59 49.56,35.59 52.04,38.1 JP3.7
  Top 0.254: v70.54,45.97 70.46,45.9 69.47,45.9 68.73,45.16 68.73,44.22 67.97,43.46 62.28,43.46 61.37,42.55 61.37,39.29 60.17,38.1 JP3.7
  Bottom 0.254: v70.54,45.97 91.44,45.97 93.14,47.68 93.14,60.11 R31.1
M0E3  (via drill 0.6)
  Top 0.203: U1.27 38.33,35.54 39.32,36.07 49.25,36.07 53.85,40.66 55.88,40.66 JP3.6
  Top 0.254: v70.49,47.83 70.18,47.52 68.58,47.52 67.51,46.46 67.51,44.73 67.23,44.45 62.13,44.45 60.5,42.82 60.5,41.27 59.84,40.62 56.64,40.62 56.49,40.77 56.03,40.77 JP3.6 | v80.49,72.69 80.49,72.97 79.45,74.02 76.4,74.02 76,74.42 76,75.26 v75.9,75.36
  Bottom 0.254: v70.49,47.83 77.04,47.83 78.18,48.97 78.18,65.43 78.74,65.99 79.96,65.99 80.29,66.32 80.29,72.49 v80.49,72.69 | v75.9,75.36 74.98,75.36 74.68,75.06 74.68,73.77 R33.1
M0E4
  Top 0.203: U1.28 38.22,36.04 39.37,36.65 48.21,36.65 54.81,43.26 56.08,43.26 JP3.5
  Bottom 0.254: JP3.5 58.42,43.18 58.95,42.65 58.95,31.88 60.38,30.45 75.69,30.45 76.89,29.26 76.89,24.12 R35.1
M0E5
  Top 0.203: U1.29 38.11,36.54 39.32,37.19 47.9,37.19 52.88,42.16 52.88,44.4 54.18,45.7 55.88,45.7 JP3.4
  Bottom 0.254: JP3.4 59.11,45.72 60.33,44.5 60.33,32.46 61.39,31.39 88.75,31.39 90.93,29.21 90.93,23.92 R37.1
M0E6
  Top 0.203: U1.30 38.13,37.04 39.34,37.77 47.24,37.77 49.83,40.36 49.83,46.02 52.04,48.23 56.13,48.23 JP3.3
  Bottom 0.254: JP3.3 59.54,48.26 61.54,46.25 61.54,33.43 62.23,32.74 106.17,32.74 107.34,31.57 107.34,30.25 107.7,29.9 115.87,29.9 118.26,27.51 118.26,23.63 R39.1
M0E7  (via drill 0.6)
  Top 0.203: U1.31 38.15,37.54 39.01,38.08 40.01,38.71 40.31,38.89 46.33,38.89 47.29,39.85 47.29,48.28 49.78,50.77 55.88,50.77 JP3.2
  Top 0.254: v104.75,34.47 104.75,34.42 103.58,33.25 103.58,32.11 v104.01,31.67
  Bottom 0.254: JP3.2 61.26,50.8 63.09,48.97 63.09,34.04 63.4,33.73 104.01,33.73 v104.75,34.47 | v104.01,31.67 104.01,26.29 105.28,25.02 105.28,23.69 R41.1
M0E8  (via drill 0.6)
  Top 0.203: U1.32 37.65,39.13 37.92,39.4 45.95,39.4 46.41,39.85
  Top 0.254: 46.41,39.85 46.41,48.92 49.02,51.54 53.77,51.54 54.15,51.92 54.15,53.11 54.33,53.29 56.11,53.29 JP3.1 64.08,53.34 v64.95,52.48 | v76.56,50.42 101.35,50.42 v101.47,50.55
  Bottom 0.254: v64.95,52.48 64.97,52.48 66.34,51.1 75.87,51.1 v76.56,50.42 | v101.47,50.55 101.47,58.95 102.59,60.07 103.65,60.07 R43.1
M1  (via drill 0.6)
  Top 0.254: U1.19 43.54,31.54 48.23,26.85 55.98,26.85 JP4.3 57.25,26.67 58.55,27.96 59.87,27.96 61.47,29.57 61.47,33.25 62,33.78 64.92,33.78 67.03,35.89 73.74,35.89 v73.94,35.69 | v74.47,40.66 74.47,39.1 R19.1
  Bottom 0.254: v73.94,35.69 73.94,40.13 v74.47,40.66
M2
  Top 0.254: U1.20 43.93,32.04 46.81,29.16 55.85,29.16 JP4.2 59.74,29.21 60.48,29.95 60.48,33.5 61.47,34.49 64.67,34.49 66.07,35.89 66.07,36.55 66.52,36.93 93.85,36.93 94.06,37.31 94.06,38.27 R22.1
M3
  Top 0.254: U1.21 44.52,32.54 45.39,31.67 56.08,31.67 JP4.1 56.21,31.7 59.36,31.7 59.72,32.05 59.72,33.88 61.14,35.31 64.14,35.31 64.99,36.16 R25.1
MUX-A0  (via drill 0.6)
  Top 0.254: DB3.14 71.6,61.01 72.87,59.74 85.17,59.74 | 85.17,59.74 99.29,59.74 | 99.29,59.74 110.72,59.74 DB1.14 112.09,61.11 114.45,61.11 115.85,59.72 v115.82,55.4 | DB8.14 99.29,59.74 | DB2.14 85.32,59.89 85.17,59.74 | M-A0.C 115.15,45.17 v115.49,45.52 | DB6.14 116.79,12.75 117.75,13.72 117.75,31.8 v115.44,34.11 | R17.1 Q3.3 93.58,40.7 94.34,41.45 94.34,42.8 94.84,43.31 102.26,43.31 102.97,44.02 102.97,45.36 103.58,45.97 110.62,45.95 113.11,48.39 115.38,48.39 v115.49,48.28 | U$4.1 U$4.2 62.13,12.7 v63.78,12.7
  Bottom 0.254: 72.06,11.48 67.44,11.48 66.29,12.7 v63.78,12.7 | 72.06,11.48 85.7,11.48 | 85.7,11.48 99.82,11.48 | 99.82,11.48 111.38,11.48 DB6.14 | DB7.14 99.87,11.63 99.82,11.48 | DB5.14 85.9,11.76 85.7,11.48 | DB4.14 71.93,11.68 72.06,11.48 | v115.49,48.28 v115.49,45.52 115.44,45.47 v115.44,34.11 | v115.49,48.28 115.47,55.04 v115.82,55.4 | v115.49,48.28 115.49,47.83
MUX-A1  (via drill 0.6)
  Top 0.254: DB3.16 71.88,58.47 73.08,57.28 81.28,57.28 81.41,57.2 85.14,57.2 | 85.14,57.2 99.14,57.2 | 99.14,57.2 110.46,57.2 DB1.16 111.76,58.5 114.25,58.5 114.76,57.99 114.76,54.46 115.72,53.49 v117.78,53.49 | DB8.16 99.03,57.28 99.14,57.2 | DB2.16 85.06,57.23 85.14,57.2 | M-A1.C 117.63,41.45 117.91,41.73 117.91,45.31 v117.78,45.44 | DB6.16 114.66,10.21 115.27,10.82 118.08,10.82 118.75,11.48 118.75,33.63 v117.78,34.59 | Q4.3 82.06,41.08 R20.1 82.59,41.13 82.63,41.25 86.04,41.23 87,42.09 87,43.71 87.71,44.42 99.67,44.42 100.84,45.59 100.84,46.28 101.78,47.22 110.06,47.22 112.9,50.09 117.5,50.09 v117.78,49.81 | v58.7,5.71 U$5.1 U$5.2
  Bottom 0.254: DB4.16 71.68,8.94 | 71.68,8.94 85.34,8.94 | 85.34,8.94 99.8,8.94 | 99.8,8.94 111.02,8.94 DB6.16 | DB7.16 99.62,9.04 99.8,8.94 | DB5.16 85.65,9.2 85.34,8.94 | v117.78,53.49 v117.78,49.81 v117.78,45.44 v117.78,34.59 | 71.68,8.94 59.49,8.94 58.7,8.13 v58.7,5.71
MUX-A2  (via drill 0.6)
  Top 0.254: DB3.18 72.14,55.93 73.28,54.79 81.36,54.79 81.48,54.66 85.32,54.66 | 85.32,54.66 99.26,54.66 | 99.26,54.66 110.72,54.66 DB1.18 112.01,55.96 113.74,55.96 114.05,55.65 114.05,53.95 115.49,52.5 v120.45,52.5 | DB8.18 99.29,54.69 99.26,54.66 | DB2.18 85.32,54.66 | M-A2.C 119.28,39.7 119.3,39.73 119.3,45.06 v119.48,45.24 119.48,45.97 118.75,46.71 113.59,46.71 112.01,44.86 105.38,44.86 104.83,44.32 104.83,41.78 103.64,40.6 Q5.3 101.15,40.6 R23.1 | DB6.18 113.82,7.67 116.05,9.91 119.2,9.91 119.79,10.49 119.79,35.2 v119.43,35.56 | v62,5.92 U$6.1 U$6.2
  Bottom 0.254: 71.76,6.4 85.85,6.4 | 85.85,6.4 99.87,6.4 | 99.87,6.4 111.33,6.4 DB6.18 | DB7.18 99.87,6.4 | DB5.18 85.9,6.48 85.85,6.4 | DB4.18 71.93,6.6 71.76,6.4 | v120.45,52.5 119.48,51.54 v119.48,45.24 119.43,45.19 v119.43,35.56 | 71.76,6.4 62.66,6.4 v62,5.92
MUX-A3  (via drill 0.6)
  Top 0.254: DB3.20 71.09,52.4 71.73,51.77 72.97,51.77 | 72.97,51.77 85.09,51.77 | 85.09,51.77 99.21,51.77 | 99.21,51.77 111.94,51.77 | 111.94,51.77 119.15,51.77 120.65,50.27 120.65,37.72 | 120.65,37.72 120.65,10.01 119.53,8.89 116.43,8.89 115.34,7.8 115.34,5.82 114.58,5.11 113.28,5.08 DB6.20 | DB8.20 99.03,51.94 99.21,51.77 | DB1.20 111.73,51.97 111.94,51.77 | DB2.20 85.06,51.79 85.09,51.77 | M-A3.C 120.6,37.77 120.65,37.72 | Q6.3 69.5,40.88 R26.1 72.52,51.31 72.97,51.77 | U$7.1 U$7.2 63.14,3.3 v63.27,3.17
  Bottom 0.254: DB4.20 71.68,4.14 72.07,3.75 | 72.07,3.75 72.36,3.45 85.78,3.45 | 85.78,3.45 99.75,3.45 | 99.75,3.45 111.99,3.45 112.45,3.91 112.45,5 DB6.20 | DB5.20 85.65,3.58 85.78,3.45 | DB7.20 99.62,3.58 99.75,3.45 | 72.07,3.75 71.5,3.17 v63.27,3.17
MUX-OUT  (via drill 0.6)
  Top 0.254: DB3.12 71.91,63.55 73.18,62.28 85.04,62.28 | 85.04,62.28 99.34,62.28 | 99.34,62.28 v106.53,62.28 110.46,62.28 DB1.12 | DB8.12 99.03,62.59 99.34,62.28 | DB2.12 85.06,62.31 85.04,62.28 | DB6.12 114.4,15.29 115.93,16.82 115.93,31.42 v113.39,33.96
  Top 0.406: U$13.1 U$13.2 62.03,24.26 v62.71,23.57
  Bottom 0.203: 81.41,14.02 85.52,14.05 99.85,14.02 111,13.99
  Bottom 0.254: R47.1 66.46,21.02 66.68,20.8 66.68,17.09 67.16,16.56 70.36,16.56 DB4.12 80.16,15.29 81.41,14.02 | DB7.12 99.62,14.25 99.85,14.02 | DB5.12 85.65,14.07 85.52,14.05 | v113.39,33.96 113.39,48.36 112.4,49.35 107.21,49.35 106.71,49.86 106.71,61.87 v106.53,62.28 | 111,13.99 DB6.12
  Bottom 0.406: R47.1 64.66,20.98 63.65,20.98 63.27,20.6 Q15.3 62.79,20.74 62.79,22.23 | 62.79,22.23 62.79,23.5 v62.71,23.57 62.71,22.3 62.79,22.23
MUX-OUT-LV
  Top 0.178: U1.15 35.15,26.47 35.36,26.26 37.26,26.26 39.42,24.11 39.42,20.57 39.7,20.3 51.33,20.3 52.65,21.61 56.13,21.61 JP4.5
  Bottom 0.406: JP4.5 R46.1 60.44,21.58 Q15.2
N$1
  Top 0.254: S1.1 S1.2 34.63,7.86 R4.1
N$2
  Top 0.178: 31.17,27.25 31.17,28.53 U1.7
  Top 0.254: 31.17,27.25 31.17,26.34 30.71,25.88 L1.2
  Top 0.406: 30.96,25.36 L1.2
N$3  (via drill 0.6)
  Top 0.178: U1.5 30.15,27.73 30.15,27.53
  Top 0.203: v29.97,22.15 30.96,22.15 31.17,21.95
  Top 0.406: C1.A 31.17,20.4 31.17,21.95 31.17,22.23 30.77,23.25 30.81,23.29 L1.1 30.8,23.34 29.87,23.34 29.51,23.65 29.51,26.24 30.15,26.8 30.15,27.53
  Bottom 0.203: C13.1 30.89,21.72 30.48,22.12 30,22.12 v29.97,22.15
N$4  (via drill 0.6)
  Top 0.254: U1.17 37.65,30.2 38.13,29.72 v38.74,29.11 Q1.1
  Bottom 0.203: C7.1 39.33,25.97 38.48,26.82 38.48,28.85 v38.74,29.11
N$5
  Top 0.178: U1.3 29.15,27.7 28.14,26.7 28.14,23.11 27.38,22.35
  Top 0.203: 27.38,22.35 27.38,21.97 26.8,21.39 26.06,21.39 25.76,21.08 25.76,20.07 SJ1.2
N$6  (via drill 0.6)
  Top 0.203: v40.16,29.95 40.16,30.94 40.06,31.04
  Top 0.254: U1.18 40.06,31.04 41.12,31.04 Q1.4
  Bottom 0.203: C8.1 43.89,28.6 43.33,29.16 40.94,29.16 v40.16,29.95
N$7
  Top 0.203: R1.1 SJ1.3
N$8
  Top 0.203: U1.2 28.65,27.94 27.15,26.67 27.15,23.22 26.92,22.99 25.73,22.99 | C6.1 25.39,24.67 25.73,24.33 25.73,22.99 Q2.1
  Top 0.254: 25.73,22.99 Q2.1
N$9
  Top 0.203: C5.1 22.86,27.82 Q2.3
  Top 0.254: U1.1 27.47,28.54 27.03,28.98 23.8,28.98 23.39,28.57 23.39,27.45 Q2.3
N$10
  Top 0.203: R2.1 SJ1.1
N$11  (via drill 0.6)
  Top 0.203: v35.69,34.87 36.35,34.87 36.68,34.54 U1.25
  Top 0.254: 40.67,34.54 C12.A 40.89,34.82 38.94,34.82 38.38,34.54 U1.25
  Bottom 0.203: L2.2 35.47,36.04 C10.1 35.51,35.05 v35.69,34.87
N$12  (via drill 0.6)
  Top 0.203: v34.04,33.86 36.63,33.86 36.8,34.04 U1.24 | JP1.P$1 39.9,44.35 v40.36,43.89
  Bottom 0.203: v34.04,33.86 34.25,33.64 C14.1 35.9,33.55 37.31,33.55 37.74,33.98 37.74,43.41 38.23,43.89 v40.36,43.89
N$13
  Top 0.178: U1.4 29.65,27.49 28.6,26.44 28.6,15.62 29.08,15.14 30.86,15.14 31.2,14.8 R3.1
  Top 0.254: R4.2 32.83,12.72 C15.1 31.23,12.75 R3.1
N$14
  Top 0.254: R10.1 45.95,9.32 46.2,9.07 46.2,7.44 S2.1 S2.2
N$15
  Top 0.406: R5.1 20.12,13.03 18.8,11.71 18.77,11.71 17.96,10.9 17.96,8.47 CN1.D+
N$16
  Top 0.406: R6.1 17.5,12.39 16.71,11.58 13.26,11.58 12.98,11.33 12.98,7.85 13.69,7.11 17.09,7.11 CN1.D-
N$17
  Top 0.254: R9.1 R10.2 C16.1 41.94,7.33 41.94,5.97 41.12,5.16 JP13.1
N$18
  Top 0.203: U1.63 21.74,31.04 19.69,28.98 19.69,21.31 20.09,20.9 20.09,19.25 JP8.1
  Top 0.406: R5.2 20.12,19.18 JP8.1
N$19
  Top 0.203: U1.62 21.46,31.54 19.1,29.18 19.1,22 | 19.1,22 17.5,20.4 | 17.5,20.4 17.5,19.51 JP8.2 | 19.1,22 17.5,20.4 | 19.1,22 17.5,20.4
  Top 0.406: R6.2 17.5,19.46 JP8.2
N$20
  Top 0.254: R13.1 LED2.A
N$21
  Top 0.254: U1.42 31.15,52.72 JP2.1
N$22
  Top 0.254: U1.41 31.65,49.13 34.47,51.94 34.47,53.19 JP2.2
N$23
  Top 0.254: U1.40 32.15,48.53 35.36,51.74 36.7,51.74 37.03,52.07 37.03,53.42 JP2.3
N$24
  Top 0.254: U1.39 32.65,48.15 35.53,51.03 39.19,51.03 39.55,51.38 39.55,53.19 JP2.4
N$25
  Top 0.254: U1.38 33.15,47.86 35.64,50.34 41.28,50.34 41.96,51.03 41.96,53.37 JP2.5
N$26
  Top 0.254: U1.35 34.65,40.95 35.33,41.63 43.41,41.63 43.71,41.94 43.71,50.22 44.63,51.13 44.63,53.19 JP2.6
N$28
  Top 0.254: U1.33 44.31,40.04 45.21,40.95 45.21,48.74 JP2.8 | R52.1 JP15.2
  Bottom 0.254: JP15.2 31.47,80.24 C26.1 29.14,78.27 28.85,77.98 28.85,63.75 29.87,62.74 34.19,62.74 35.71,61.21 49.68,61.21 50.95,59.94 50.95,54.48 JP2.8
N$30  (via drill 0.6)
  Top 0.254: U$11.1 U$11.2 51.22,72.86 v51.99,73.64
  Top 0.406: C23.P$1 v58.88,76.68
  Top 1.016: v58.88,76.68 57.89,76.02 D1.C 54.48,75.9 54.48,74.27 53.77,73.61 v51.99,73.64
  Bottom 1.016: v58.88,76.68 58.88,79.23 IC1.1 | IC2.1 51.49,73.13 v51.99,73.64
N$31
  Top 1.016: D1.A 49.54,77.54 JP11.2
N$32  (via drill 0.6)
  Top 0.254: U1.34 35.15,40.66 35.46,40.97 36.14,40.97 36.45,40.66 43.84,40.66 44.48,41.3 44.48,49.02 47.09,51.64 47.09,53.42 JP2.7 47.14,54.61 46.63,55.12 25.81,55.12 25.55,55.37 v25.55,56.39 | JP14.2 26.75,80.19 R53.1 25.61,78.29 25.3,77.98 25.3,76.2 v26.57,74.93
  Bottom 0.254: C27.1 26.64,80.29 JP14.2 | v26.57,74.93 26.57,59.44 25.55,58.42 v25.55,56.39
N$33  (via drill 0.6)
  Top 0.254: U4.1 45.01,65.76 v45.42,65.35 45.44,65.33 46.36,65.33 46.89,65.86 46.89,70.38 46.57,70.7 U3.4 | U3.20 39.64,73.95 R45.2 41.55,74.3 42.14,74.88 42.14,75.11 v42.47,75.44
  Bottom 0.254: 40.18,65.94 40.77,65.35 v45.42,65.35 45.64,65.58 C21.1 | 40.18,65.94 39.9,66.22 39.9,70.86 R44.2 R45.2 40.01,74.27 42.11,74.27 | C19.A 39.32,65.48 39.73,65.48 40.18,65.94 | JP12.1 44.5,75.21 | 44.5,75.21 43.56,74.27 42.11,74.27 | v42.47,75.44 42.47,74.62 42.11,74.27 | C20.1 45.62,74.09 44.5,75.21
N$35
  Top 0.254: U3.16 40.74,76.55 41.94,77.75 41.94,82.04 JP12.2
N$36
  Top 0.254: U3.15 38.67,77.2 39.42,77.95 JP12.3
N$38  (via drill 0.6)
  Top 0.254: v35.94,67.77 35.94,69.49 TX.A
  Bottom 0.254: R44.1 37.99,68.11 37.41,67.54 36.17,67.54 v35.94,67.77
N$42
  Top 0.178: U1.14 34.65,26.05 34.95,25.76 36.96,25.76 38.81,23.9 38.81,20.17 39.32,19.66 49.12,19.66 49.73,19.05 JP4.6
N$43
  Top 0.178: U1.13 34.15,25.61 34.47,25.3 36.75,25.3 38.35,23.7 38.35,19.79 39.12,19.02 47.02,19.02 49.61,16.43 56.08,16.43 JP4.7
N$45
  Top 0.254: U1.43 30.65,41.89 28.96,43.59 27.58,43.59 26.87,44.3 26.87,53.16 JP5.8
N$46
  Top 0.254: U1.44 30.15,41.53 28.91,42.77 26.82,42.77 24.23,45.36 24.23,53.42 JP5.7
N$47
  Top 0.254: U1.45 29.65,41.24 28.78,42.11 26.29,42.11 21.84,46.56 21.84,53.11 JP5.6
N$48
  Top 0.254: U1.48 24.68,40.04 19.41,45.31 16.05,45.31 14.43,46.94 14.43,53.16 JP5.3
N$49
  Top 0.254: U1.49 26.15,39 25.91,39.24 24.51,39.24 19.38,44.37 16,44.37 13.44,46.94 13.44,50.16 | 13.44,50.16 12.32,51.28 | 12.32,51.28 11.91,51.74 11.58,52.07 JP5.2 | 13.44,50.16 12.32,51.28
N$50
  Top 0.254: U1.50 25.1,37.54 24.79,37.85 24.79,38.1 19.15,43.74 15.65,43.74 12.04,47.35 12.04,48.9 9.14,51.79 9.14,53.37 JP5.1
N$52
  Top 0.178: U1.10 32.65,27.8 32.77,27.69 32.77,24.89 33.83,23.82 36.32,23.82 36.93,23.22 36.93,18.69 38.23,17.4 42.29,17.4 43.33,16.36 JP6.2
N$53
  Top 0.178: U1.9 32.15,27.87 32.26,27.76 32.26,24.71 33.68,23.29 36.09,23.29 36.42,22.96 36.42,18.41 37.97,16.87 40.13,16.87 40.79,16.2 JP6.3
N$54
  Top 0.254: U1.51 24.5,37.04 18.52,43.03 15.39,43.03 10.16,48.26 JP7.8
N$55
  Top 0.254: U1.53 24.31,36.04 18.19,42.16 14.91,42.16 11.3,45.77 7.7,45.77 JP7.7
N$56
  Top 0.254: U1.54 23.87,35.54 18.01,41.4 14.43,41.4 12.5,43.33 8.05,43.33 JP7.6
N$59
  Top 0.254: R14.1 LED1.A
N$60
  Top 0.254: U$1.21 31.49,71.81 32.41,70.89 32.41,69.02 R14.2
N$61
  Top 0.254: U$1.19 29.56,69.41 R13.2
N$62  (via drill 0.6)
  Top 0.254: RX.A 35.89,77.19 v35.71,77.37
  Bottom 0.254: v35.71,77.37 35.99,77.09 35.99,74.88 36.63,74.24 37.94,74.24 R45.1
N$63
  Top 0.254: R16.2 87.73,38.46 Q3.1
N$64
  Top 0.254: R18.1 M-A0.A
N$65
  Top 0.254: U$1.22 28.94,73.01 R15.2
N$66
  Top 0.254: R19.2 78.23,38.86 Q4.1
N$67
  Top 0.254: R21.1 M-A1.A
N$68
  Top 0.254: R22.2 97.31,38.3 Q5.1
N$69
  Top 0.254: R24.1 113.12,39.67 M-A2.A
N$70
  Top 0.254: R25.2 68.38,38.79 Q6.1
N$71
  Top 0.254: R27.1 113.02,37.8 M-A3.A
N$72
  Top 0.254: U3.23 36.25,72 TX.C
N$73
  Top 0.254: U3.22 36.69,72.65 RX.C
N$74
  Bottom 0.305: R31.2 92.91,62.61 91.72,63.8 91.72,66.7 91.29,67.13 88.85,67.13 88.7,67.28 88.7,68.17 Q8.1
N$75
  Bottom 0.254: Q7.1 115.33,69.93 R29.2
N$76
  Bottom 0.254: Q9.1 74.67,71.91 R33.2
N$77
  Bottom 0.254: Q10.1 74.84,23.88 R35.2
N$78
  Bottom 0.254: Q11.1 R37.2
N$79
  Bottom 0.254: Q12.1 116.58,23.52 R39.2
N$80
  Bottom 0.254: Q13.1 103.39,23.6 R41.2
N$81
  Bottom 0.254: R43.2 103.68,62.2 104.32,62.84 104.32,66.42 103.61,67.13 101.83,67.13 101.63,67.33 101.63,68.1 Q14.1
N$82  (via drill 0.6)
  Top 0.254: U4.3 40.56,71.68 41.45,72.57 42.72,72.57 v42.9,72.75 | v43.15,69.04 43.18,69.04 43.46,68.76 U3.1
  Bottom 0.254: v42.9,72.75 42.9,69.29 v43.15,69.04
N$83
  Top 0.254: U4.2 41.83,70.71 42.49,71.37 45.11,71.37 U3.5
SCL  (via drill 0.6)
  Top 0.203: DB2.5 83.29,71.17 84.51,72.42 96.42,72.42 | 96.42,72.42 105.23,72.42 106.48,71.14 108.86,71.14 DB1.5 | DB8.5 96.19,72.16 96.42,72.42 | v110.97,35.33 111,35.31 111,31.67 111.3,31.37 113.16,31.37 114.58,29.95 114.58,24.77 114,24.18 111.33,24.18 110.06,22.91 DB6.5 108.2,24.18 96.67,24.18 | v106.38,48.11 74.7,48.11 v73.96,48.84 | v61.29,56.26 61.29,57.4 61.24,57.45 | DB4.5 69.16,22.91 70.36,24.11 70.36,24.13 70.41,24.18 82.88,24.18 | 82.88,24.18 96.67,24.18 | DB5.5 82.8,24.11 82.88,24.18 | DB7.5 96.77,24.08 96.67,24.18
  Top 0.254: DB3.5 68.33,71.17 69.49,72.44 79.22,72.44 80.34,71.27 82.12,71.27 DB2.5 | 59.46,72.57 56.67,72.57 56.49,72.39 56.49,64.87 56.82,64.54 U2.7 59.18,64.59 59.77,64.59 59.82,64.54 61.09,64.54 61.72,63.91 61.72,57.81 61.37,57.45 61.24,57.45 R50.1 | U$2.2 59.66,72.77 59.46,72.57 | 59.46,72.57 61.25,72.57 U$2.1 61.45,71.41 v61.75,71.12
  Bottom 0.203: v110.97,35.33 110.97,44.6 108.97,46.61 107.01,46.61 106.68,46.94 106.68,47.75 v106.38,48.11 | v73.96,48.84 64.9,48.84 61.87,51.87 61.87,55.68 v61.29,56.26
  Bottom 0.254: DB3.5 68.02,70.94 65.68,70.94 65.51,71.12 v61.75,71.12
SDA  (via drill 0.6)
  Top 0.203: v112.22,36.12 112.22,32.54 112.62,32.13 113.69,32.13 115.29,30.53 115.29,22.3 114.71,21.64 110.9,21.64 109.55,20.37 DB6.7 107.92,21.67 96.37,21.67 | v107.67,48.44 107.67,49.15 107.47,49.35 75.64,49.35 v75.01,49.99 | v63.35,55.17 59.13,55.17 58.34,55.96 58.34,59.31 58.62,59.59 59.22,59.59 R51.1 | DB4.7 68.71,20.37 70,21.67 82.52,21.67 | 82.52,21.67 96.37,21.67 | DB7.7 96.52,21.51 96.37,21.67 | DB5.7 82.55,21.64 82.52,21.67
  Top 0.254: DB3.7 68.38,68.63 69.72,69.9 80.67,69.9 DB2.7 82.32,68.63 83.59,67.36 95.63,67.36 | 95.63,67.36 107.37,67.36 DB1.7 | DB8.7 95.94,67.67 95.63,67.36 | v57.25,63.14 59,63.14 U2.6 59.16,63.3 60.93,63.3 61.14,63.09 61.14,59.89 60.88,59.64 R51.1 | U$3.2 U$3.1 57.91,68.96 v57.68,68.73
  Bottom 0.203: v112.22,36.12 112.22,45.9 110.31,47.8 107.92,47.8 107.67,48.06 v107.67,48.44 | v75.01,49.99 65.58,49.99 63.02,52.55 63.02,54.84 v63.35,55.17
  Bottom 0.254: v57.25,63.14 57.12,63.37 57.12,68.58 57.28,68.73 v57.68,68.73 67.89,68.73 DB3.7
U0RX
  Top 0.178: U1.11 33.15,25.17 34.04,24.28 36.5,24.28 37.39,23.39 37.39,19.07 38.53,17.93 44.2,17.93 45.85,16.28 45.85,13.87 JP6.1
  Bottom 0.254: JP9.TXO 9.17,17.78 10.67,16.28 31.6,16.28 35.48,12.39 45.49,12.39 45.95,12.85 45.95,13.77 JP6.1
U0TX
  Top 0.178: U1.12 33.65,25.3 34.19,24.77 36.65,24.77 37.87,23.55 37.87,19.36 38.79,18.44 46.36,18.44 50.83,13.97 JP4.8
  Bottom 0.254: JP9.RXI 31.7,15.24 35.15,11.79 55.37,11.79 55.96,12.37 55.96,13.92 JP4.8
U1RX  (via drill 0.6)
  Top 0.254: U1.57 20.65,34.04 19.02,35.66 7.75,35.66 JP7.3 | U4.6 40.54,58.42 39.78,57.66 29.59,57.66 v29.24,57.3
  Bottom 0.254: v29.24,57.3 29.24,48.74 27.38,46.89 13.18,46.89 12.07,45.77 12.07,36.6 11.13,35.66 7.75,35.66 JP7.3
U1TX  (via drill 0.6)
  Top 0.254: U1.58 8.42,33.54 JP7.2 | U4.7 41.83,57.71 40.84,56.72 31.06,56.72 v30.56,56.21
  Bottom 0.254: v30.56,56.21 30.38,56.21 30.1,55.93 30.1,47.65 27.89,45.44 14.27,45.44 13.54,44.7 13.54,34.81 12.27,33.54 8.42,33.54 JP7.2
U3RX  (via drill 0.6)
  Top 0.254: U1.46 29.15,40.95 28.63,41.48 25.6,41.48 19.18,47.9 19.18,53.44 JP5.5 | U$1.14 22.79,63.41 22.5,63.12 22.5,61.75 23.22,61.04 23.22,57.63 22.68,57.1 20.37,57.1 v20.24,56.97
  Bottom 0.254: JP10.RXI 9.12,60.63 9.5,60.25 9.5,56.03 10.08,55.45 18.85,55.45 19.25,55.04 | 19.25,55.04 19.25,53.52 JP5.5 | v20.24,56.97 20.24,56.03 19.25,55.04
U3TX
  Top 0.254: U1.47 28.65,40.74 28.47,40.92 25.2,40.92 19.71,46.41 17.3,46.41 16.66,47.04 JP5.4 16.64,53.24 16.64,55.09 | JP10.TXO 8.74,63.17 9.27,62.64 9.27,56.29 9.75,55.8 16.15,55.8 16.64,55.32 16.64,55.09 | U$1.13 24.25,56.18 23.72,55.65 17.2,55.65 16.64,55.09
VBUSD
  Top 0.406: R7.1 R8.2 12.31,13.76 JP16.1
VUSB
  Top 0.406: R7.2 14.4,9.09 14.73,8.76 16.02,8.76 CN1.VBUS
  Bottom 0.406: JP17.1 10.8,6.99 12.62,8.81 15.97,8.81 CN1.VBUS

## Text on the board
tPlace: PA12 | PA19 | PA18 | PB11 | PB10 | PB09 | PB08 | PA17 | PA16 | PA15 | PA14 | PA13 | PA31 | PA30 | PA29 | PA28 | PA27 | PA11 | PA10 | PA20 | PB12 | PA09 | PB13 | PB07 | PA21 | PB06 | PA22 | PA08 | PB14 | RJ | PA07 | PB15 | PA23 | PA06 | PB05 | PB04 | PA05 | PA24 | PA25 | PA04 | PB03 | TCK | PA03 | PB00 | PB02 | PA26 | PB01
tNames: SCL | VIN | SDA | 5v | GND | 3.3v
_tsilk: JP11 | R53 | R52 | D1 | DB3 | DB2 | DB8 | DB1 | C17 | RX | SCL | R15 | TX | VIN | U3 | SDA | LED2 | R13 | + | R14 | + | U2 | LED1 | U4 | C25 | C22 | R51 | R50 | R49 | JP5 | JP2 | R48 | JP3 | PA12 | PA19 | PA18 | PB11 | PB10 | PB09 | PB08 | PA17 | PA16 | PA15 | PA14 | PA13 | PA31 | PA30 | PA29 | PA28 | PA27 | R11 | R12 | PA11 | PA10 | PA20 | PB12 | JP1 | PA09 | + | PB13 | PB07 | R18 | + | M-A0 | Q6 | R26 | R20 | Q3 | Q5 | PA21 | R21 | + | M-A1 | PB06 | PA22 | R24 | + | M-A2 | R25 | PA08 | R19 | Q4 | R16 | R17 | R22 | R23 | R27 | M-A3 | PB14 | RJ | PA07 | PB15 | C12 | JP4 | 5v | PA23 | Q2 | PA06 | Q1 | JP7 | PB05 | DB4 | DB5 | DB7 | DB6 | C5 | U1 | PB04 | C6 | PA05 | L1 | JP8 | PA24 | PA25 | SJ1 | PA04 | PB03 | R1 | R2 | C1 | C11 | TCK | PA03 | PB00 | PB02 | R8 | JP9 | PA26 | C15 | R6 | R5 | PB01 | R3 | JP6 | R7 | R4 | R10 | GND | S1 | S2 | R9 | 3.3v | C16 | CN1
_bsilk: C18 | C24 | C27 | C26 | IC1 | R45 | R33 | C20 | R29 | R44 | R32 | IC2 | Q9 | Q8 | C21 | Q7 | Q14 | C19 | R30 | R42 | R28 | R31 | R43 | C9 | C10 | C4 | L2 | C14 | C3 | C2 | C7 | C8 | R35 | R37 | R41 | R39 | Q10 | C13 | Q11 | Q13 | Q12 | R47 | Q15 | R46 | R34 | R36 | R40 | R38